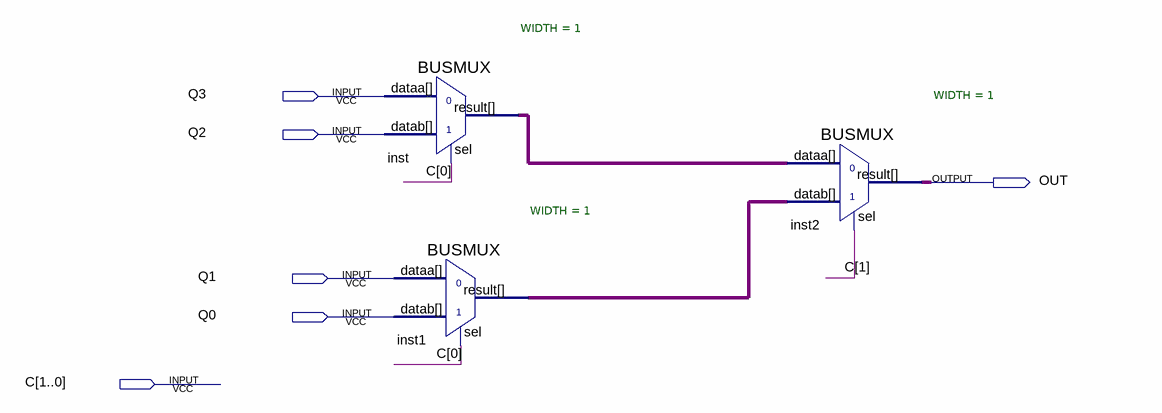
[diagram p0: schematic sheet]
// Quartus schematic MUX4-1.bdf as structural Verilog: 3 symbols, 6 pins
module \MUX4-1  (
  input  Q3,
  input  Q2,
  input  Q1,
  input  Q0,
  input  [1:0] C,
  output OUT
);

  wire inst1_result, inst_result;

  BUSMUX #(.WIDTH(1)) inst (.datab(Q2), .sel(C[0]), .dataa(Q3), .result(inst_result));
  BUSMUX #(.WIDTH(1)) inst1 (.datab(Q0), .sel(C[0]), .dataa(Q1), .result(inst1_result));
  BUSMUX #(.WIDTH(1)) inst2 (.datab(inst1_result), .sel(C[1]), .dataa(inst_result), .result(OUT));
endmodule
